# EasyEDA Pro project encoder.eprj

# Schematic Schematic1
Board Name: Board1; Create Date: 2025-01-06
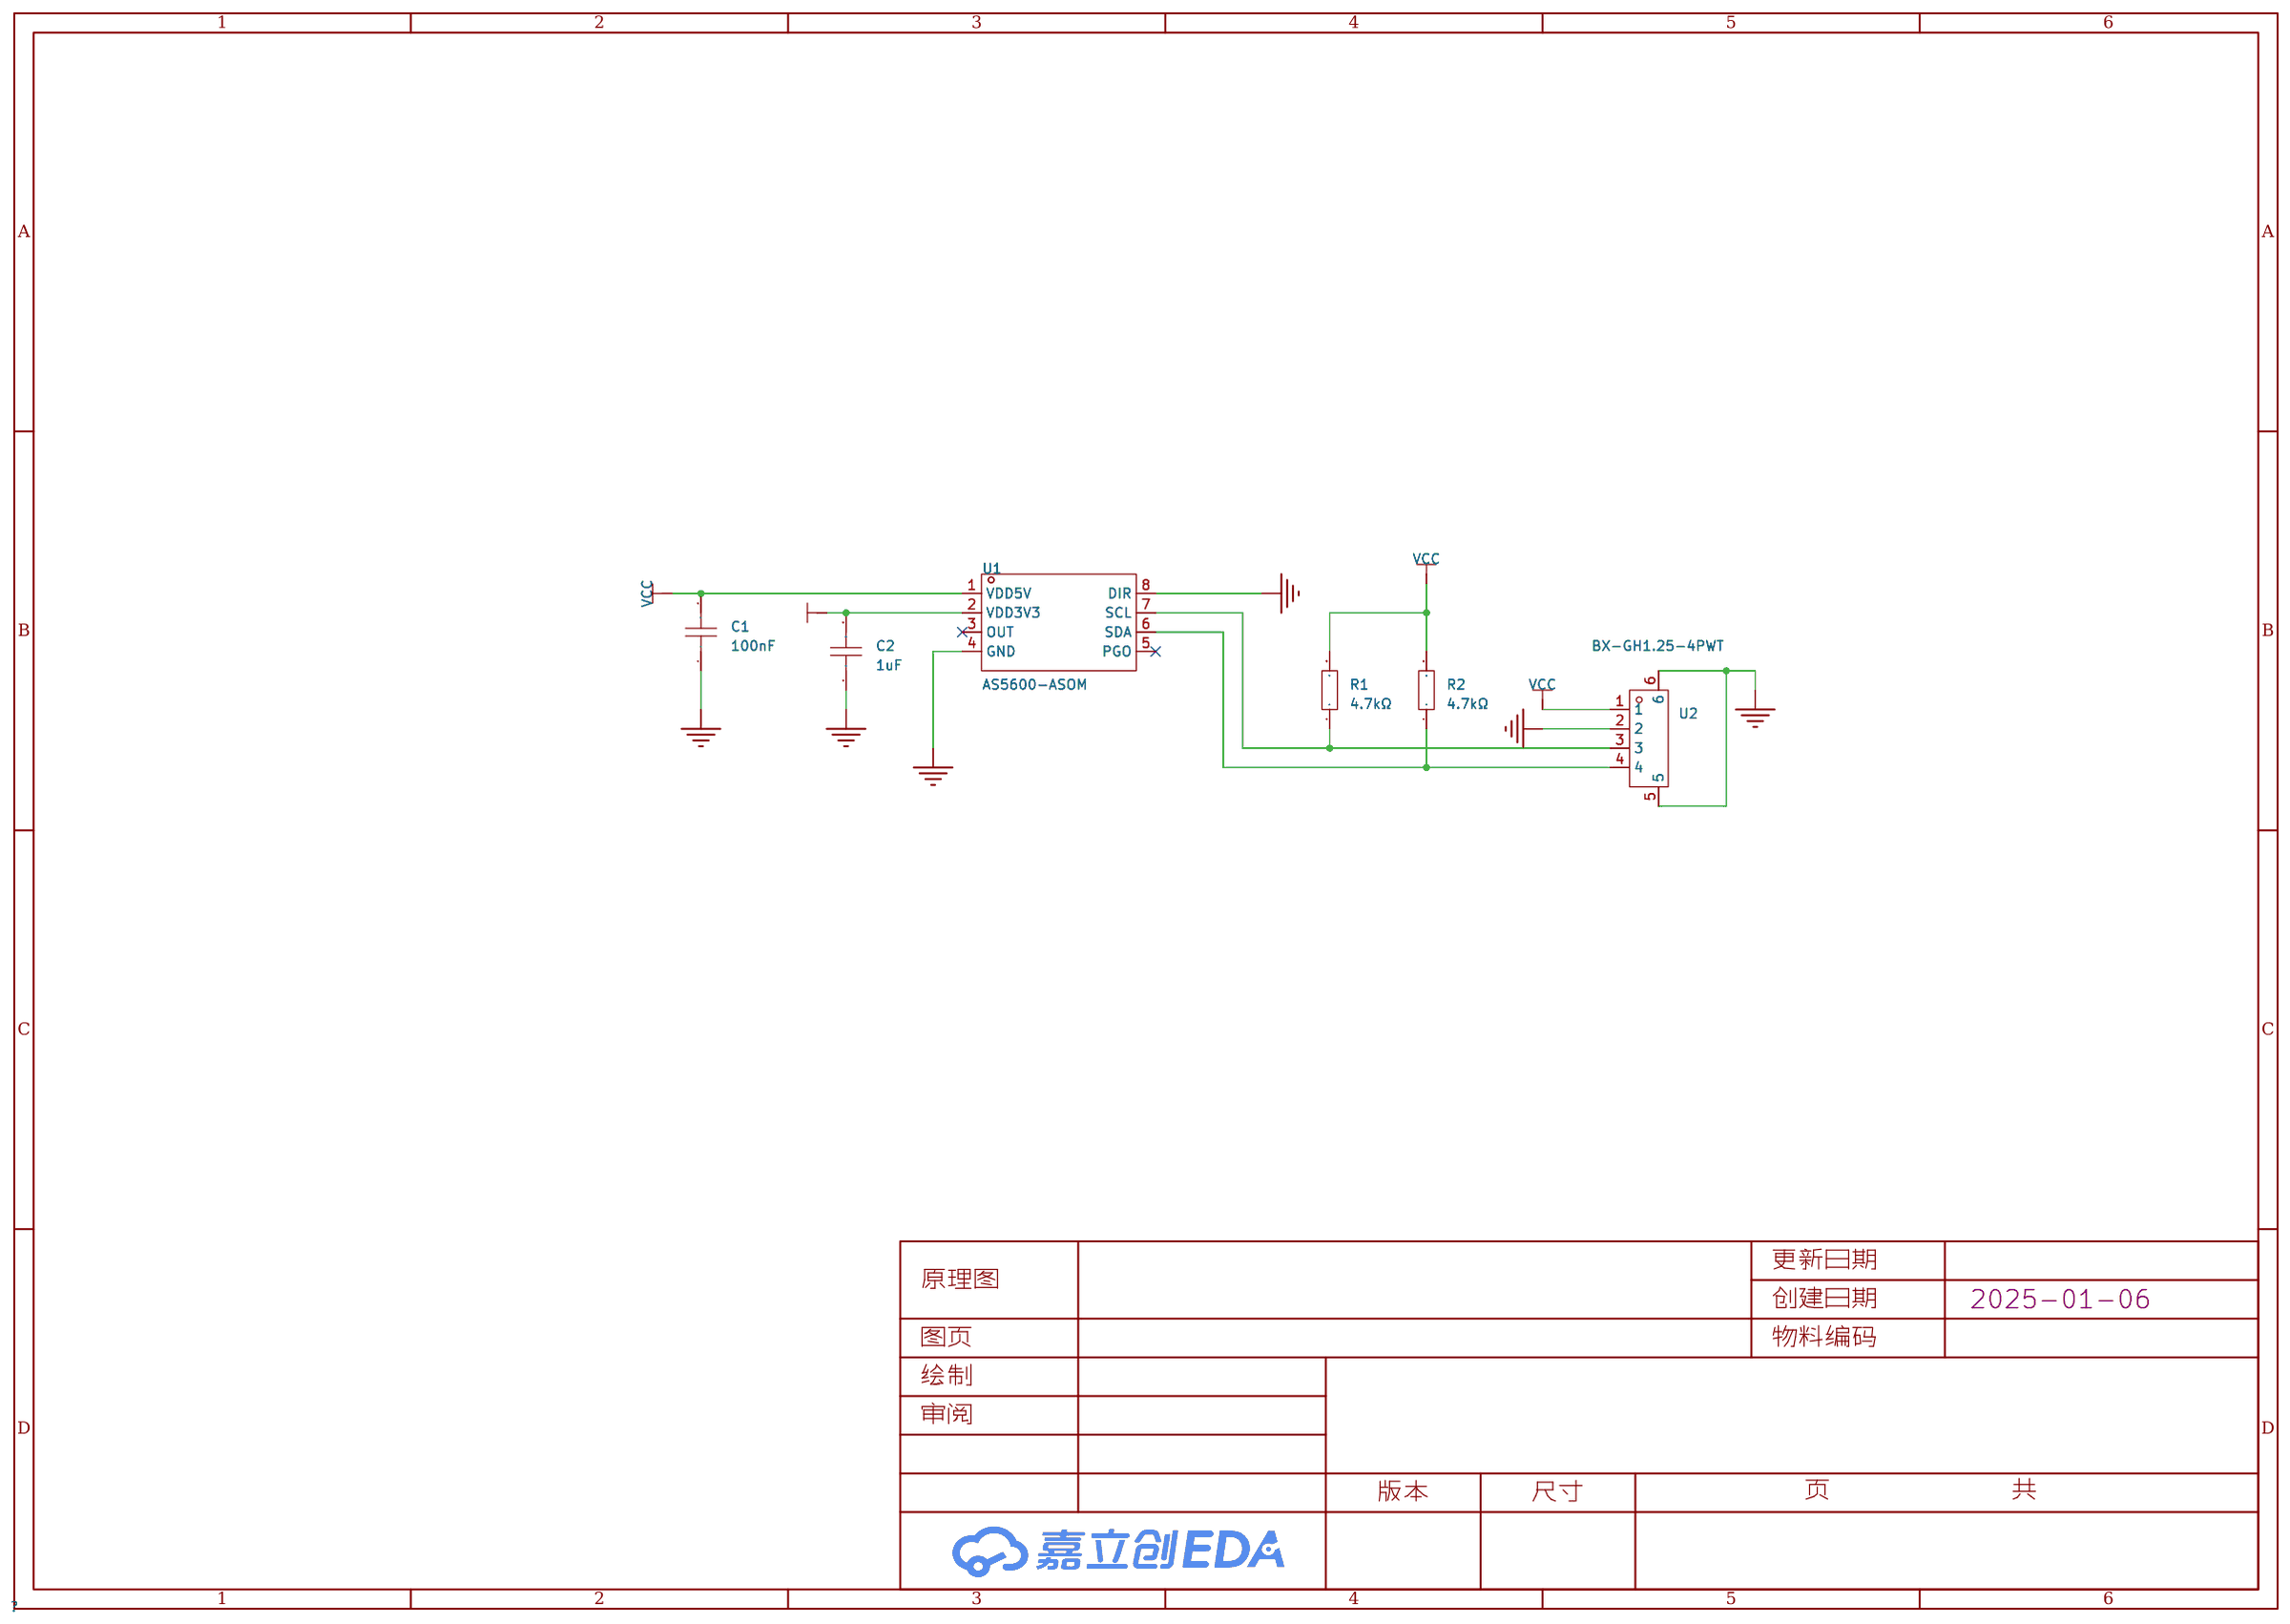
[diagram p0: schematic sheet]

## Parts
C1  100nF  [C0603]
C2  1uF  [C0603]
R1  4.7kΩ  [R0603]
R2  4.7kΩ  [R0603]
U1  AS5600-ASOM  [SOIC-8_L5.0-W4.0-P1.27-LS6.0-BL]
U2  BX-GH1.25-4PWT  [CONN-SMD_4P-P1.25_BX-GH1.25-4PWT]

## Library data of the parts
C1 C2 = CGA0603X7R104K500JT: LCSC Part Name: 100nF ±10% 50V; Supplier Part: C6119867; Manufacturer: HRE(芯声); Supplier Footprint: 0603; JLCPCB Part Class: 扩展库; Supplier: LCSC; Tolerance: ±10%; Voltage Rated: 50V; Temperature Coefficient: X7R
R1 R2 = 0603WAF4701T5E: LCSC Part Name: 4.7kΩ ±1% 100mW 厚膜电阻; Supplier Part: C23162; Manufacturer: UNI-ROYAL(厚声); Supplier Footprint: 0603; JLCPCB Part Class: 基础库; Datasheet: https://atta.szlcsc.com/upload/public/pdf/source/20200306/C422600_1E6D84923E4A46A82E41ADD87F860B5C.pdf; Supplier: LCSC; Type: 厚膜电阻; Tolerance: ±1%; Power(Watts): 100mW; Overload Voltage (Max): 75V; Temperature Coefficient: ±100ppm/℃; Operating Temperature Range: -55℃~+155℃
U1 = AS5600-ASOM: Supplier Part: C79815; Manufacturer: ams(艾迈斯半导体); Supplier Footprint: SOIC-8; JLCPCB Part Class: 扩展库; Datasheet: https://atta.szlcsc.com/upload/public/pdf/source/20161027/1477535527192.pdf; Supplier: LCSC; Supply Voltage: 5V；3.3V; Rotation Angle: 0°~360°
U2 = BX-GH1.25-4PWT: LCSC Part Name: 配套胶壳型号：BX-GH1.25-4PJK 配套端子型号：BX-GH1.25-DZ 配套杜邦线型号：BX-GH1.25-4PBXC; Supplier Part: C18077720; Manufacturer: Bossie(博锡); Supplier Footprint: SMD,P=1.25mm,卧贴; JLCPCB Part Class: 扩展库; Datasheet: https://atta.szlcsc.com/upload/public/pdf/source/20231017/B66D9CA4205922AD4D2D93130B005F0C.pdf; Supplier: LCSC; Pins Structure: 1x4P; Pitch: 1.25mm; Mounting Style: 卧贴; Reference Series: GH; Number of Pins: 4P; Number of Rows: 1; Number of PINs Per Row: 4; Current Rating (Max): 1A; Contact Material: 磷铜; Contact Plating: 锡; Operating Temperature Range: -25℃~+85℃

## Nets
GND: C1.1 C2.1 U1.4(GND) U1.8(DIR) U2.2 U2.5 U2.6
VCC: C1.2 R1.2 R2.2 U1.1(VDD5V) U2.1
VCC3.3: C2.2 U1.2(VDD3V3)
$1N221: R1.1 U1.7(SCL) U2.3
$1N227: R2.1 U1.6(SDA) U2.4

Not connected (* = marked no-connect by the designer): U1 3(OUT)* 5(PGO)*

# Board PCB1
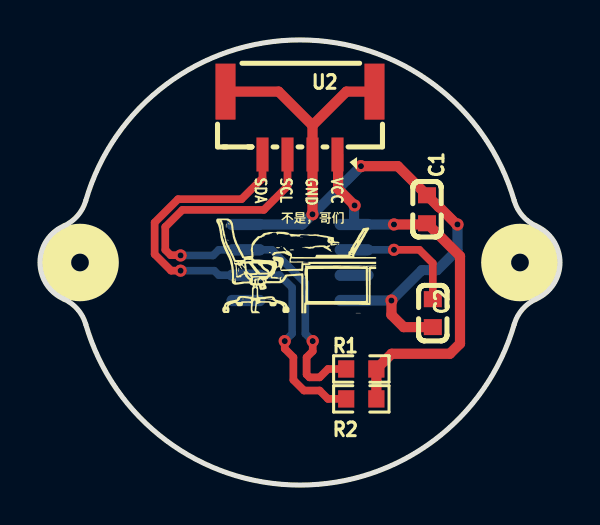
[diagram p1: board, top side]
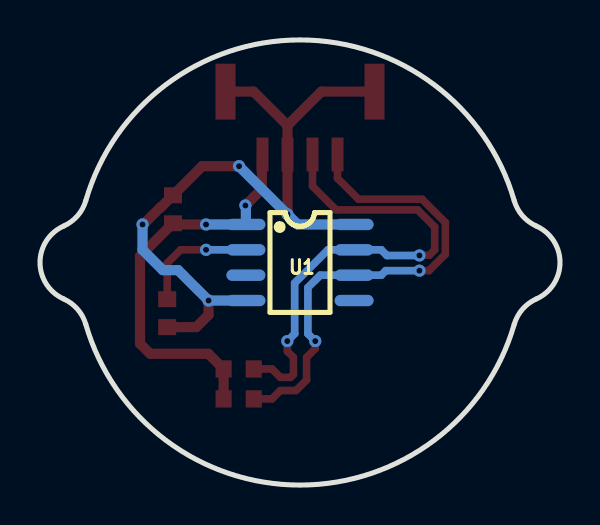
[diagram p2: board, bottom side, seen from below]

Outline 26 x 22.3 mm; copper layers: Top Layer, Bottom Layer. Coordinates in mm from the lower left corner of the outline.
Outline path: 1.18,9.32 arc(0,11.15) 1.18,12.98 arc(1.88,13.49) 2.29,14.25 arc(13,22.3) 23.71,14.25 arc(24.12,13.49) 24.82,12.98 arc(26,11.15) 24.82,9.32 arc(24.12,8.81) 23.71,8.05 arc(13,0) 2.29,8.05 arc(1.88,8.81) 1.18,9.32
Stack: Top Layer 0.035mm / Dielectric1 1.51mm FR4 er 4.5 / Bottom Layer 0.035mm

## Design rules (mm)
net $1N221: DP1
net $1N227: DP1
template: JLCPCB Capability(Two Layers Board)
spacing copperThickness1oz (default): track to track 0.102, other pairs 0.152 to 0.3
spacing copperThickness2oz: track to track 0.203, other pairs 0.152 to 0.3
track width copperThickness1oz (default): min 0.127, default 0.254, max 2.54
track width copperThickness2oz: min 0.203, default 0.254, max 2.54
differential pair differentialPair (default): width min 0.127, default 0.254, max 2.54; gap min 0.152, default 0.152
via viaSize (default): diameter min 0.5, default 0.61, max 10; hole min 0.3, default 0.305, max 6.3

## Placement (name value [footprint] x y rotation side)
C1  100nF  [C0603]  19.35 13.82 270 top
C2  1uF  [C0603]  19.64 8.61 90 top
R1  4.7kΩ  [R0603]  16.07 5.82 0 top
R2  4.7kΩ  [R0603]  16.07 4.32 0 top
U1  AS5600-ASOM  [SOIC-8_L5.0-W4.0-P1.27-LS6.0-BL]  13 11.15 270 bottom
U2  BX-GH1.25-4PWT  [CONN-SMD_4P-P1.25_BX-GH1.25-4PWT]  13 18.13 180 top

## Footprints (pads in the part's own frame, mm; a bottom-side part is the same pattern mirrored in y, then rotated)
C0603
  rect 0.8x0.9 smd: 1(-0.7,0) 2(0.7,0)
CONN-SMD_4P-P1.25_BX-GH1.25-4PWT
  rect 0.6x1.7 smd: 1(-1.875,1.575) 2(-0.625,1.575) 3(0.625,1.575) 4(1.875,1.575)
  rect 1x2.8 smd: 5(3.725,-1.575) 6(-3.725,-1.575)
R0603
  rect 0.806x0.864 smd: 1(-0.753,0) 2(0.753,0)
SOIC-8_L5.0-W4.0-P1.27-LS6.0-BL
  oval 0.569x1.95 smd: 1(-1.905,-2.705) 2(-0.635,-2.705) 3(0.635,-2.705) 4(1.905,-2.705) 5(1.905,2.705) 6(0.635,2.705) 7(-0.635,2.705) 8(-1.905,2.705)

## Nets
As in the schematic.

Pads without a net: U1 3 5

## Via types
v1: diameter 0.61, hole 0.305, Top Layer to Bottom Layer, 11 vias

## Routing (per net, layer and track width the routed paths; a pad name or vN(x,y) marks a point on that pad's centre or on a via; arc(x,y) is an arc through that point)
GND: length 36.8
  Top Layer w0.508: v1(16.05,15.98) 17.89,15.98 C1.1 19.94,13.92 19.97,13.92 20.84,13.05 v1(20.87,13.05) ; v1(13.63,13.56) U2.2 13.63,18.02 ; C2.1 18.19,7.91 17.57,8.53 v1(17.57,9.24) ; U2.5 11.93,19.71 13.63,18.02 ; 13.63,18.02 15.32,19.71 U2.6
  Bottom Layer w0.508: U1.8 13.12,13.05 v1(13.63,13.56) 13.64,13.56 v1(16.05,15.98) ; v1(20.87,13.05) 20.87,11.78 19.86,10.77 19.1,10.77 v1(17.57,9.24) U1.4
VCC: length 20.5
  Top Layer w0.508: v1(17.7,13.05) 19.29,13.05 C1.2 21,11.47 21,7.09 20.49,6.58 17.58,6.58 16.82,5.82 16.82,4.32 ; U2.1 14.91,16.53 14.91,14.83 v1(15.73,14.01)
  Bottom Layer w0.508: v1(17.7,13.05) U1.1 15.71,13.98 v1(15.73,14.01)
VCC3.3: length 6
  Top Layer w0.381: C2.2 19.64,11.11 18.97,11.78 v1(17.7,11.78)
  Bottom Layer w0.381: U1.2 v1(17.7,11.78)
$1N221: length 24.7
  Top Layer w0.381: U2.3 12.38,14.97 11.19,13.79 7.12,13.79 6.27,12.93 6.27,11.78 6.53,11.52 7.02,11.52 v1(7.03,11.5) ; v1(13.64,7.21) 13.64,6.7 13.33,6.4 13.33,5.54 13.47,5.4 13.98,5.4 14.4,5.82 R1.1
  Bottom Layer w0.381: v1(7.03,11.5) 8.66,11.5 8.94,11.78 U1.7 11.6,11.78 13.27,10.12 13.27,7.58 v1(13.64,7.21)
$1N227: length 24.6
  Top Layer w0.381: U2.4 11.13,15.37 10.07,14.32 6.9,14.32 5.73,13.15 5.73,11.56 6.56,10.74 v1(7.03,10.74) ; v1(12.24,7.21) 12.24,6.83 12.67,6.4 12.67,5.27 13.2,4.74 13.98,4.74 14.4,4.32 R2.1
  Bottom Layer w0.381: v1(7.03,10.74) 8.71,10.74 8.94,10.51 U1.6 11.98,10.51 12.61,9.89 12.61,7.58 v1(12.24,7.21)

## Text on the board
Top Silkscreen Layer: SDA | SCL | GND | VCC
